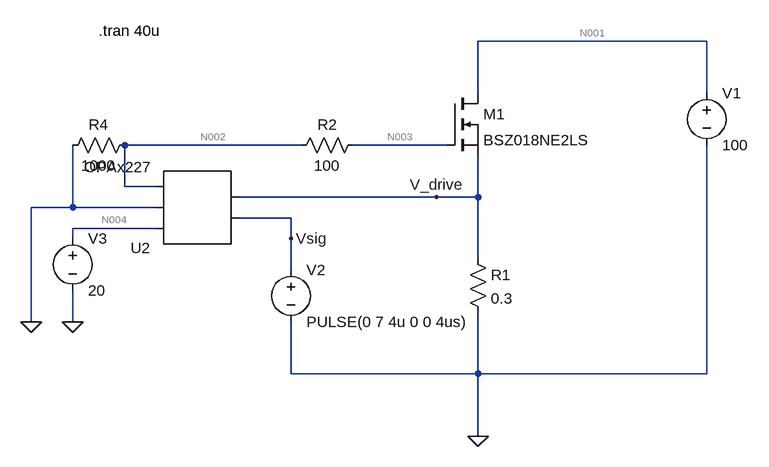
[diagram p0: schematic Electronic Load Control Loop.asc]
* Electronic Load Control Loop.asc
* U2: OPAx227 (symbol AutoGenerated\OPAx227 not available, pins judged from their places): pin1=Vsig pin2=V_drive pin3=N004 pin4=0 pin5=N002
M1 N001 N003 V_drive V_drive BSZ018NE2LS
V1 N001 0 100
R1 V_drive 0 0.3
V2 Vsig 0 PULSE(0 7 4u 0 0 4us)
V3 N004 0 20
R2 N003 N002 100
R4 N002 0 1000
.model NMOS NMOS
.model PMOS PMOS
.lib standard.mos
.tran 40u
.backanno
.end

* Results of the author's LTspice run, read from the files saved beside the schematic
* Operating Point, zero values left out:
*   V(n002) = 4.287 V
*   V(n004) = 20 V
*   V(v_drive) = 2 V
*   V(n001) = 100 V
*   V(n003) = 4.287 V
*   Id(M1) = 6.708 A
*   Is(M1) = -6.708 A
*   I(R1) = 6.668 A
*   I(R4) = 4.287 mA
*   I(V1) = -6.708 A
*   I(V2) = 39.99 mA
*   I(V3) = -7.987 mA
*   Ix(u2:IN+) = -39.99 mA
*   Ix(u2:IN-) = 39.99 mA
*   Ix(u2:VCC) = 7.987 mA
*   Ix(u2:VEE) = -3.7 mA
*   Ix(u2:OUT) = -4.287 mA
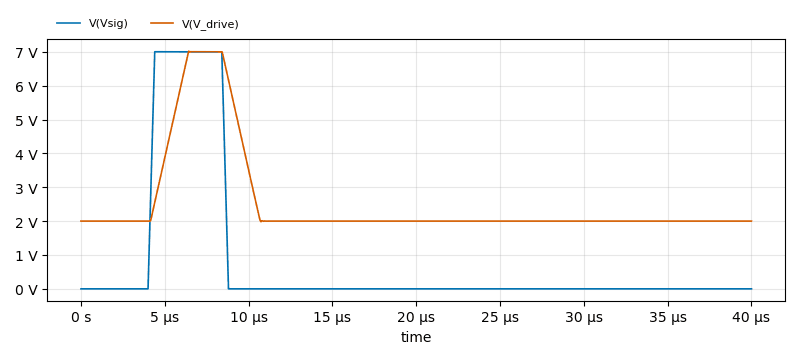
[diagram p1: Transient Analysis of Electronic Load Control Loop.asc, plotted from the saved traces]
* Transient Analysis, 1 run:
*   V(Vsig): min 0 V, max 7 V, average 770 mV, rms 2.291 V, last 0 V
*   V(V_drive): min 1.985 V, max 7.016 V, average 2.534 V, rms 2.889 V, last 2 V